# Altium schematic sheet 核心板.SchDoc
size A3
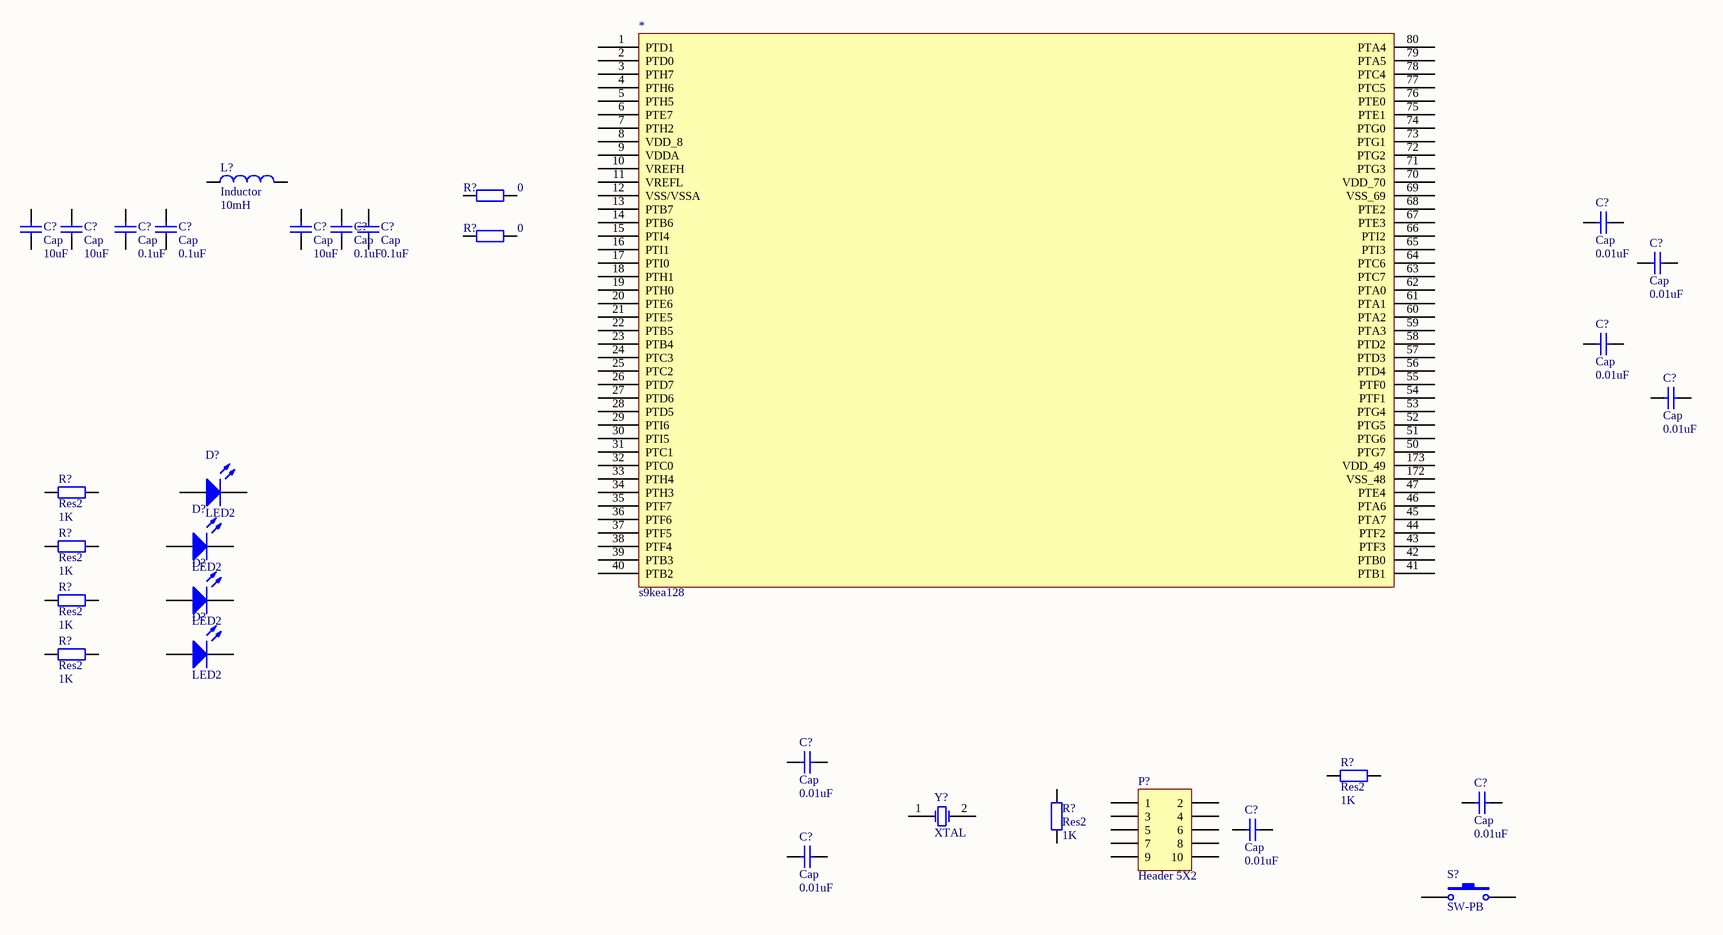
[diagram p0: 核心板.SchDoc]

## Parts
(Parts that share a designator on the sheet are numbered #1, #2 ... from top to bottom, then left to right.)
*  s9kea128  [LQFP80]
C?#1  Cap  value 0.01uF  [RAD-0.3]
C?#2  Cap  value 10uF  [RAD-0.3]
C?#3  Cap  value 10uF  [RAD-0.3]
C?#4  Cap  value 0.1uF  [RAD-0.3]
C?#5  Cap  value 0.1uF  [RAD-0.3]
C?#6  Cap  value 10uF  [RAD-0.3]
C?#7  Cap  value 0.1uF  [RAD-0.3]
C?#8  Cap  value 0.1uF  [RAD-0.3]
C?#9  Cap  value 0.01uF  [RAD-0.3]
C?#10  Cap  value 0.01uF  [RAD-0.3]
C?#11  Cap  value 0.01uF  [RAD-0.3]
C?#12  Cap  value 0.01uF  [RAD-0.3]
C?#13  Cap  value 0.01uF  [RAD-0.3]
C?#14  Cap  value 0.01uF  [RAD-0.3]
C?#15  Cap  value 0.01uF  [RAD-0.3]
D?#1  LED2  [3.2X1.6X1.1]
D?#2  LED2  [3.2X1.6X1.1]
D?#3  LED2  [3.2X1.6X1.1]
D?#4  LED2  [3.2X1.6X1.1]
L?  Inductor  value 10mH  [0402-A]
P?  Header 5X2  [HDR2X5]
R?#1  value 0  [AXIAL-0.4]  (hidden comment: Res2)
R?#2  value 0  [AXIAL-0.4]  (hidden comment: Res2)
R?#3  Res2  value 1K  [AXIAL-0.4]
R?#4  Res2  value 1K  [AXIAL-0.4]
R?#5  Res2  value 1K  [AXIAL-0.4]
R?#6  Res2  value 1K  [AXIAL-0.4]
R?#7  Res2  value 1K  [AXIAL-0.4]
R?#8  Res2  value 1K  [AXIAL-0.4]
S?  SW-PB  [SPST-2]
Y?  XTAL  [R38]

## Nets

Not connected (* = marked no-connect by the designer): * 1(PTD1) 2(PTD0) 3(PTH7) 4(PTH6) 5(PTH5) 6(PTE7) 7(PTH2) 8(VDD_8) 9(VDDA) 10(VREFH) 11(VREFL) 12(VSS/VSSA) 13(PTB7) 14(PTB6) 15(PTI4) 16(PTI1) 17(PTI0) 18(PTH1) 19(PTH0) 20(PTE6) 21(PTE5) 22(PTB5) 23(PTB4) 24(PTC3) 25(PTC2) 26(PTD7) 27(PTD6) 28(PTD5) 29(PTI6) 30(PTI5) 31(PTC1) 32(PTC0) 33(PTH4) 34(PTH3) 35(PTF7) 36(PTF6) 37(PTF5) 38(PTF4) 39(PTB3) 40(PTB2) 41(PTB1) 42(PTB0) 43(PTF3) 44(PTF2) 45(PTA7) 46(PTA6) 47(PTE4) 50(PTG7) 51(PTG6) 52(PTG5) 53(PTG4) 54(PTF1) 55(PTF0) 56(PTD4) 57(PTD3) 58(PTD2) 59(PTA3) 60(PTA2) 61(PTA1) 62(PTA0) 63(PTC7) 64(PTC6) 65(PTI3) 66(PTI2) 67(PTE3) 68(PTE2) 69(VSS_69) 70(VDD_70) 71(PTG3) 72(PTG2) 73(PTG1) 74(PTG0) 75(PTE1) 76(PTE0) 77(PTC5) 78(PTC4) 79(PTA5) 80(PTA4) 172(VSS_48) 173(VDD_49); C?#1 1 2; C?#2 1 2; C?#3 1 2; C?#4 1 2; C?#5 1 2; C?#6 1 2; C?#7 1 2; C?#8 1 2; C?#9 1 2; C?#10 1 2; C?#11 1 2; C?#12 1 2; C?#13 1 2; C?#14 1 2; C?#15 1 2; D?#1 1(A) 2(K); D?#2 1(A) 2(K); D?#3 1(A) 2(K); D?#4 1(A) 2(K); L? 1 2; P? 1 2 3 4 5 6 7 8 9 10; R?#1 1 2; R?#2 1 2; R?#3 1 2; R?#4 1 2; R?#5 1 2; R?#6 1 2; R?#7 1 2; R?#8 1 2; S? 1 2; Y? 1(OSC1) 2(OSC2)

## Library data of the parts
C?#1-C?#15 = Cap: Capacitor; Published: 8-Jun-2000; LatestRevisionDate: 17-Jul-2002; LatestRevisionNote: Re-released for DXP Platform.; PackageReference: RAD-0.3; Publisher: Altium Limited; PackageDescription: Radial Cap, Thru-Hole; 2 Leads; 0.3 in Pin Spacing
D?#1-D?#4 = LED2: Typical RED, GREEN, YELLOW, AMBER GaAs LED; Published: 8-Jun-2000; LatestRevisionDate: 17-Jul-2002; LatestRevisionNote: Re-released for DXP Platform.; PackageVersion: Feb-2002; PackageReference: 3.2X1.6X1.1; Publisher: Altium Limited; PackageDescription: SM LED; 2 Flat Leads
L? = Inductor: Code_IEC: 1005; Published: 8-Jun-2000; LatestRevisionDate: 29-May-2009; LatestRevisionNote: IPC-7351 Footprint Added.; PackageReference: 0402-A; Publisher: Altium Limited; PackageDescription: Chip Inductor; Code_JEITA: 0402
P? = Header 5X2: Header, 5-Pin, Dual row; LatestRevisionDate: 17-Jul-2002; LatestRevisionNote: Re-released for DXP Platform.; Publisher: Altium Limited
R?#1-R?#8 = Res2: Resistor; Published: 8-Jun-2000; LatestRevisionDate: 17-Jul-2002; LatestRevisionNote: Re-released for DXP Platform.; PackageReference: AXIAL-0.4; Publisher: Altium Limited; PackageDescription: Axial Device, Thru-Hole; 2 Leads; 0.4 in Pin Spacing
S? = SW-PB: Switch; Published: 24-Mar-1999; LatestRevisionDate: 17-Jul-2002; LatestRevisionNote: Re-released for DXP Platform.; PackageReference: SPST-2; Publisher: Altium Limited; PackageDescription: Switch; 2 Leads
Y? = XTAL: Crystal Oscillator; Published: 8-Jun-2000; LatestRevisionDate: 17-Jul-2002; LatestRevisionNote: Re-released for DXP Platform.; PackageReference: R38; Publisher: Altium Limited; PackageDescription: Crystal, Thru-Hole; 2 Leads; Body 3.1 x 8.2 mm (Dia.xH)